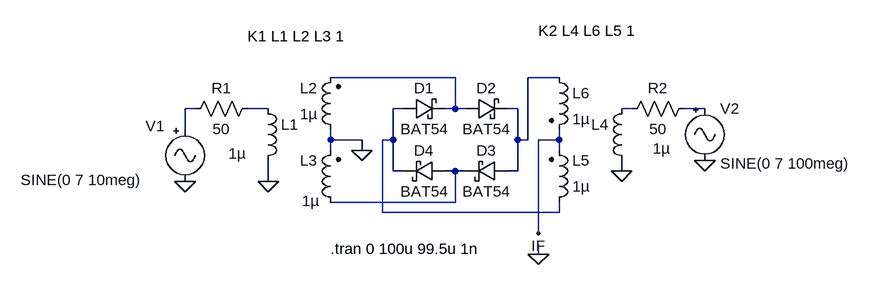
[diagram p0: schematic Diode_ring_mixer.asc]
Diode_ring_mixer.asc, the LTspice schematic file:
Version 4.1
SHEET 1 948 680
WIRE 192 64 0 64
WIRE 352 64 304 64
WIRE -208 112 -224 112
WIRE -96 112 -128 112
WIRE 112 112 96 112
WIRE 192 112 192 64
WIRE 192 112 176 112
WIRE 208 112 192 112
WIRE 288 112 272 112
WIRE 464 112 448 112
WIRE 576 112 544 112
WIRE -224 144 -224 112
WIRE 0 160 0 144
WIRE 48 160 0 160
WIRE 96 160 96 112
WIRE 96 160 80 160
WIRE 288 160 288 112
WIRE 304 160 304 64
WIRE 304 160 288 160
WIRE 352 160 352 144
WIRE 352 160 320 160
WIRE 0 176 0 160
WIRE 48 176 48 160
WIRE 352 176 352 160
WIRE 96 208 96 160
WIRE 112 208 96 208
WIRE 192 208 176 208
WIRE 208 208 192 208
WIRE 288 208 288 160
WIRE 288 208 272 208
WIRE 448 208 448 192
WIRE -96 224 -96 192
WIRE 192 256 192 208
WIRE 192 256 0 256
WIRE 80 272 80 160
WIRE 352 272 352 256
WIRE 352 272 80 272
WIRE 320 304 320 160
WIRE 320 336 320 320
FLAG -96 224 0
FLAG 576 192 0
FLAG -224 224 0
FLAG 48 176 0
FLAG 448 208 0
FLAG 320 304 IF
FLAG 320 336 0
SYMBOL schottky 112 128 R270
WINDOW 0 32 32 VTop 2
WINDOW 3 0 32 VBottom 2
SYMATTR InstName D1
SYMATTR Value BAT54
SYMBOL schottky 208 128 R270
WINDOW 0 32 32 VTop 2
WINDOW 3 0 32 VBottom 2
SYMATTR InstName D2
SYMATTR Value BAT54
SYMBOL schottky 272 192 R90
WINDOW 0 0 32 VBottom 2
WINDOW 3 32 32 VTop 2
SYMATTR InstName D3
SYMATTR Value BAT54
SYMBOL schottky 176 192 R90
WINDOW 0 0 32 VBottom 2
WINDOW 3 32 32 VTop 2
SYMATTR InstName D4
SYMATTR Value BAT54
SYMBOL Misc\\signal -224 128 R0
WINDOW 0 -61 11 Left 2
WINDOW 3 -253 94 Left 2
SYMATTR InstName V1
SYMATTR Value SINE(0 7 10meg)
SYMBOL Misc\\signal 576 96 R0
WINDOW 3 24 100 Left 2
SYMATTR Value SINE(0 7 100meg)
SYMATTR InstName V2
SYMBOL ind -112 96 R0
WINDOW 3 -45 85 Left 2
SYMATTR Value 1µ
SYMATTR InstName L1
SYMBOL ind2 16 160 R180
WINDOW 0 36 80 Left 2
WINDOW 3 36 40 Left 2
SYMATTR InstName L2
SYMATTR Value 1µ
SYMBOL ind2 16 272 R180
WINDOW 0 36 80 Left 2
WINDOW 3 33 18 Left 2
SYMATTR InstName L3
SYMATTR Value 1µ
SYMBOL ind 464 96 M0
WINDOW 3 -59 77 Left 2
SYMATTR Value 1µ
SYMATTR InstName L4
SYMBOL ind2 336 272 M180
WINDOW 0 36 80 Left 2
WINDOW 3 36 40 Left 2
SYMATTR InstName L5
SYMATTR Value 1µ
SYMBOL ind2 336 48 R0
SYMATTR InstName L6
SYMATTR Value 1µ
SYMBOL res -112 96 R90
WINDOW 0 0 56 VBottom 2
WINDOW 3 32 56 VTop 2
SYMATTR InstName R1
SYMATTR Value 50
SYMBOL res 560 96 R90
WINDOW 0 0 56 VBottom 2
WINDOW 3 32 56 VTop 2
SYMATTR InstName R2
SYMATTR Value 50
TEXT 0 328 Left 2 !.tran 0 100u 99.5u 1n
TEXT -128 0 Left 2 !K1 L1 L2 L3 1
TEXT 320 -8 Left 2 !K2 L4 L6 L5 1

The netlist it stands for:
* Diode_ring_mixer.asc
D1 N005 N001 BAT54
D2 N001 N002 BAT54
D3 N002 N008 BAT54
D4 N008 N005 BAT54
V1 N003 0 SINE(0 7 10meg)
V2 N007 0 SINE(0 7 100meg)
L1 N004 0 1µ
L2 0 N001 1µ
L3 N008 0 1µ
L4 N006 0 1µ
L5 N005 IF 1µ
L6 N002 IF 1µ
R1 N004 N003 50
R2 N007 N006 50
.model D D
.lib standard.dio
.tran 0 100u 99.5u 1n
K1 L1 L2 L3 1
K2 L4 L6 L5 1
.backanno
.end